# EAGLE design Session 4 (EAGLE 9.6.2)
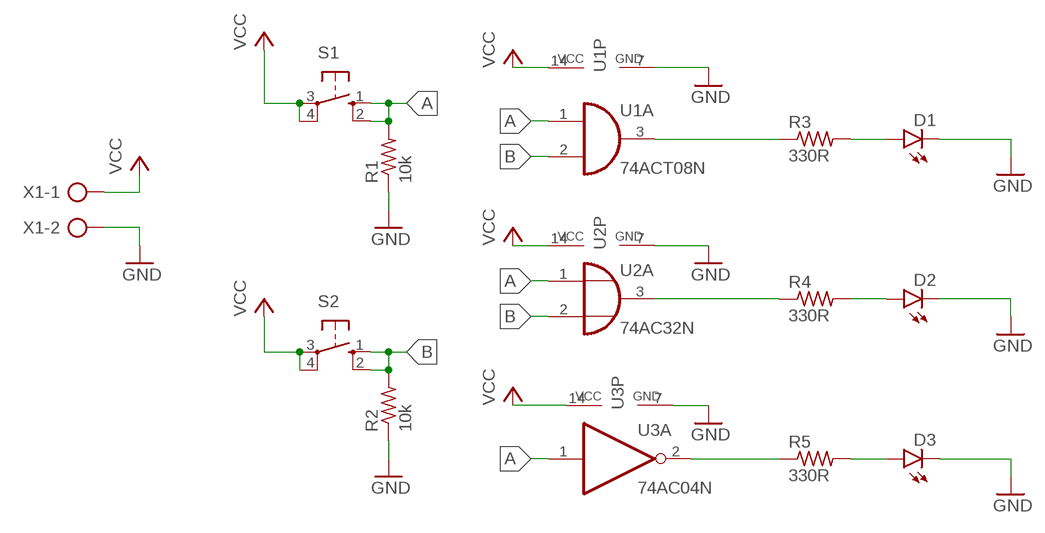
[diagram p0: schematic, sheet 1]

## Parts
D1  LED5MM  [LED5MM]
D2  LED5MM  [LED5MM]
D3  LED5MM  [LED5MM]
R1  10k  R-US_0204/7  [0204/7]
R2  10k  R-US_0204/7  [0204/7]
R3  330R  R-US_0204/7  [0204/7]
R4  330R  R-US_0204/7  [0204/7]
R5  330R  R-US_0204/7  [0204/7]
S1  10-XX  [B3F-10XX]
S2  10-XX  [B3F-10XX]
U1  74ACT08N  [DIL14]
U2  74AC32N  [DIL14]
U3  74AC04N  [DIL14]
X1  AK500/2  [AK500/2]

## Nets
A: R1.2 S1.1(S) S1.2(S1) U1.1(A:I0) U2.1(A:I0) U3.1(A:I)
B: R2.2 S2.1(S) S2.2(S1) U1.2(A:I1) U2.2(A:I1)
GND: D1.K(C) D2.K(C) D3.K(C) R1.1 R2.1 U1.7(P:GND) U2.7(P:GND) U3.7(P:GND) X1.2
N$4: R3.1 U1.3(A:O)
N$5: D1.A R3.2
N$6: R5.1 U3.2(A:O)
N$7: D3.A R5.2
N$9: D2.A R4.2
N$10: R4.1 U2.3(A:O)
VCC: S1.3(P) S1.4(P1) S2.3(P) S2.4(P1) U1.14(P:VCC) U2.14(P:VCC) U3.14(P:VCC) X1.1
Unconnected: U1.4(B:I0) U1.5(B:I1) U1.6(B:O) U1.8(C:O) U1.9(C:I0) U1.10(C:I1) U1.11(D:O) U1.12(D:I0) U1.13(D:I1) U2.4(B:I0) U2.5(B:I1) U2.6(B:O) U2.8(C:O) U2.9(C:I0) U2.10(C:I1) U2.11(D:O) U2.12(D:I0) U2.13(D:I1) U3.3(B:I) U3.4(B:O) U3.5(C:I) U3.6(C:O) U3.8(D:O) U3.9(D:I) U3.10(E:O) U3.11(E:I) U3.12(F:O) U3.13(F:I)

## Library data of the parts
D1-D3 = led:LED: LED OSRAM: - CHIPLED LG R971, LG N971, LY N971, LG Q971, LY Q971, LO R971, LY R971 LH N974, LH R974 LS Q976, LO Q976, LY Q976 LO Q996 - Hyper CHIPLED LW Q18S LB Q993, LB Q99A, LB R99A - SideLED LS A670, LO A670, LY A670, LG A670, LP A670 LB A673, LV A673, LT A673, LW A673 LH A674 LY A675 LS A676, LA A676, LO A676, LY A676, LW A676 LS A679, LY A679, LG A679 - Hyper Micro SIDELED® LS Y876, LA Y876, LO Y876, LY Y876 LT Y87S - SmartLED LW L88C, LW L88S LB L89C, LB L89S, LG L890 LS L89K, LO L89K, LY L89K LS L896, LA L896, LO L896, LY L896 - TOPLED LS T670, LO T670, LY T670, LG T670, LP T670 LSG T670, LSP T670, LSY T670, LOP T670, LYG T670 LG T671, LOG T671, LSG T671 LB T673, LV T673, LT T673, LW T673 LH T674 LS T676, LA T676, LO T676, LY T676, LB T676, LH T676, LSB T676, LW T676 LB T67C, LV T67C, LT T67C, LS T67K, LO T67K, LY T67K, LW E67C LS E67B, LA E67B, LO E67B, LY E67B, LB E67C, LV E67C, LT E67C LW T67C LS T679, LY T679, LG T679 LS T770, LO T770, LY T770, LG T770, LP T770 LB T773, LV T773, LT T773, LW T773 LH T774 LS E675, LA E675, LY E675, LS T675 LS T776, LA T776, LO T776, LY T776, LB T776 LHGB T686 LT T68C, LB T68C - Hyper Mini TOPLED® LB M676 - Mini TOPLED Santana® LG M470 LS M47K, LO M47K, LY M47K Source: http://www.osram.convergy.de LUXEON: - LUMILED® LXK2-PW12-R00, LXK2-PW12-S00, LXK2-PW14-U00, LXK2-PW14-V00 LXK2-PM12-R00, LXK2-PM12-S00, LXK2-PM14-U00 LXK2-PE12-Q00, LXK2-PE12-R00, LXK2-PE12-S00, LXK2-PE14-T00, LXK2-PE14-U00 LXK2-PB12-K00, LXK2-PB12-L00, LXK2-PB12-M00, LXK2-PB14-N00, LXK2-PB14-P00, LXK2-PB14-Q00 LXK2-PR12-L00, LXK2-PR12-M00, LXK2-PR14-Q00, LXK2-PR14-R00 LXK2-PD12-Q00, LXK2-PD12-R00, LXK2-PD12-S00 LXK2-PH12-R00, LXK2-PH12-S00 LXK2-PL12-P00, LXK2-PL12-Q00, LXK2-PL12-R00 Source: www.luxeon.com KINGBRIGHT: KA-3528ASYC Source: www.kingbright.com
R1-R5 = rcl:R-US_: RESISTOR, American symbol; SPICEPREFIX: R
S1 S2 = switch-omron:10-XX: OMRON SWITCH; MPN: B3F-1000; OC_FARNELL: 176432; OC_NEWARK: 36M3542
U1 = 74xx-eu:74*08: Quad 2-input AND gate
U2 = 74xx-eu:74*32: Quad 2-input OR gate
U3 = 74xx-eu:74*04: Hex INVERTER
X1 = con-ptr500:AK500/2: CONNECTOR; OC_FARNELL: unknown; OC_NEWARK: unknown

## Board
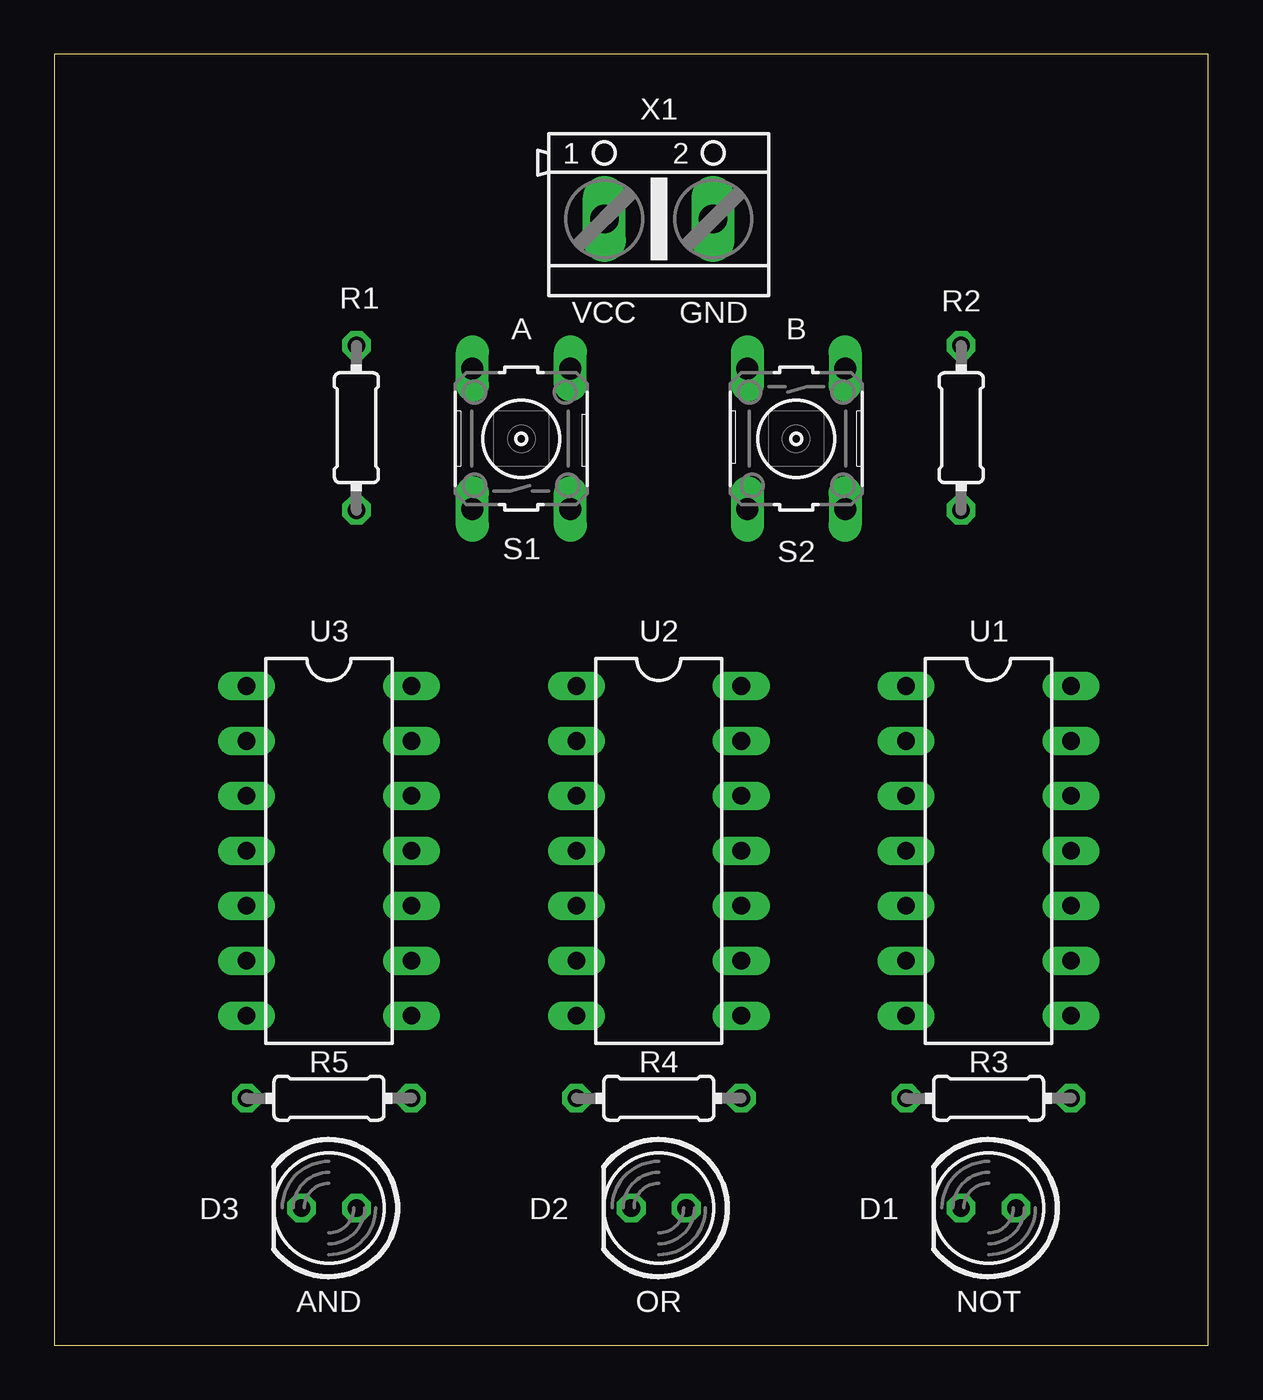
[diagram p1: board, top side]
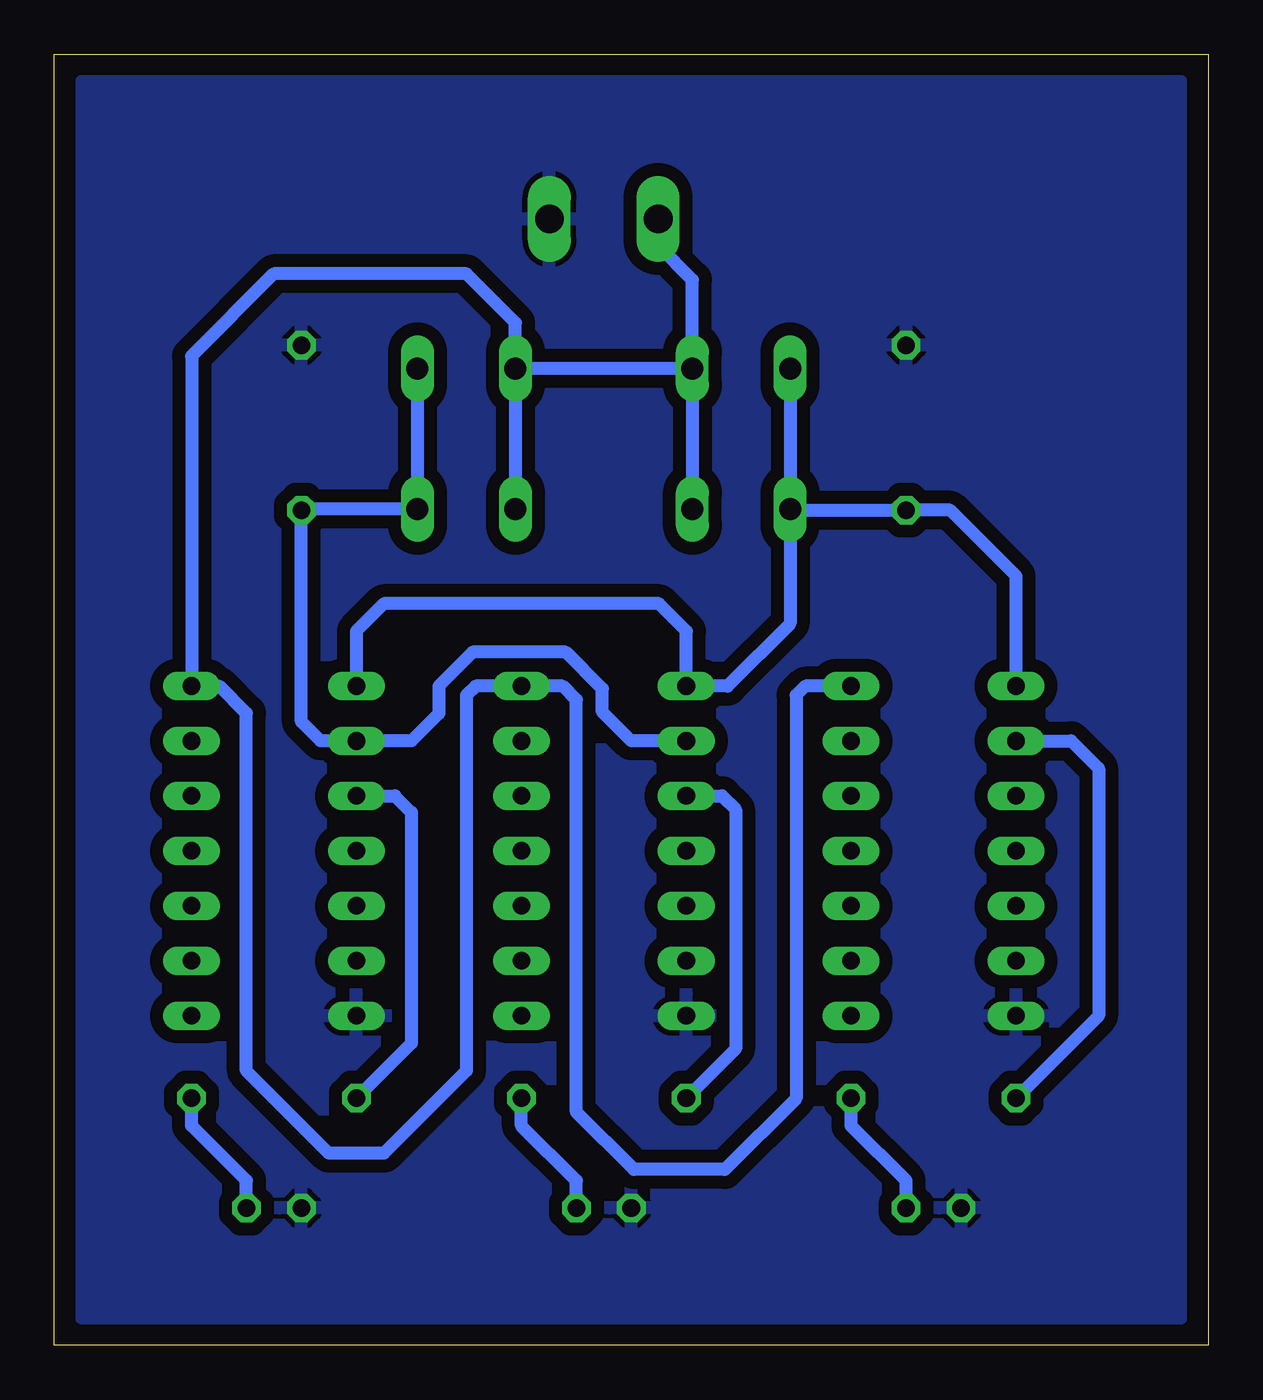
[diagram p2: board, bottom side, seen from below]

Size 53.34 x 59.69 mm. Coordinates in mm from the lower left corner, seen from the top.
Outline: 0,0 53.34,0 53.34,59.69 0,59.69 0,0
Copper layers (1*16): Top 0.035mm / dielectric 1.5mm / Bottom 0.035mm
Design rules "default *": minimum track width 0.6mm, minimum drill 0.6mm, track to track 0.6mm, track to pad 0.6mm, pad to pad 0.6mm, via to via 0.6mm, smd to smd 6mil, copper to edge 0.6mm, drill to drill 0.6mm, minimum pad ring 10mil, minimum via ring 8mil, stop-mask expansion 4mil, vias tented up to drill 0mil, thermal gap 10mil

### Footprints (pad centres in the part's own frame; a part is rotated, then mirrored left to right if it is on the bottom)
LED5MM = drill 0.813 octagon: A -1.27,0; K 1.27,0
0204/7 = drill 0.813 octagon: 1 -3.81,0; 2 3.81,0
B3F-10XX = drill 1.016 long: 1 -3.251,2.261; 2 3.251,2.261; 3 -3.251,-2.261; 4 3.251,-2.261
DIL14 = drill 0.813 long: 1 -7.62,-3.81; 2 -5.08,-3.81; 3 -2.54,-3.81; 4 0,-3.81; 5 2.54,-3.81; 6 5.08,-3.81; 7 7.62,-3.81; 8 7.62,3.81; 9 5.08,3.81; 10 2.54,3.81; 11 0,3.81; 12 -2.54,3.81; 13 -5.08,3.81; 14 -7.62,3.81
AK500/2 = drill 1.321 long: 1 -2.515,0; 2 2.515,0

### Placement (x,y rotation side)
D1  43.18,6.35 180 top
D2  27.94,6.35 180 top
D3  12.7,6.35 180 top
R1  13.97,42.42 270 top
R2  41.91,42.42 270 top
R3  43.18,11.43 0 top
R4  27.94,11.43 0 top
R5  12.7,11.43 0 top
S1  21.59,41.91 90 top
S2  34.29,41.91 270 top
U1  43.18,22.86 270 top
U2  27.94,22.86 270 top
U3  12.7,22.86 270 top
X1  27.94,52.07 0 top

### Tracks (layer width: path | path; a pad name or v marks a point on that pad's centre or on a via)
A
  Bottom 0.6: S1.2 S1.1 | S1.1 19.28,38.61 R1.2 11.94,38.61 8.89,35.56 U3.1 | U1.1 39.37,33.02 38.1,34.29 25.4,34.29 24.13,33.02 U2.1 22.23,30.48 19.33,33.38 S1.1
B
  Bottom 0.6: S2.1 S2.2 41.86,38.66 R2.2 41.91,28.83 41.02,27.94 U1.2 36.83,27.94 35.56,29.21 35.56,30.48 34,32.04 29.71,32.04 28.01,30.34 28.01,29.28 26.67,27.94 U2.2
GND
  pour Bottom: 1.27,1.27 1.27,58.42 52.07,58.42 52.07,1.27
N$4
  Bottom 0.6: U1.3 37.59,25.4 36.83,24.64 36.83,13.97 R3.1
N$5
  Bottom 0.6: D1.A 44.45,7.62 46.99,10.16 R3.2
N$6
  Bottom 0.6: U3.2 6.35,27.94 5.08,26.67 5.08,15.24 R5.1
N$7
  Bottom 0.6: D3.A 13.97,7.62 16.51,10.16 R5.2
N$9
  Bottom 0.6: D2.A 29.21,7.62 31.75,10.16 R4.2
N$10
  Bottom 0.6: U2.3 22.48,25.4 21.84,24.77 21.84,13.72 R4.1
VCC
  Bottom 0.6: S1.4 S2.3 | S1.4 S1.3 | S2.3 S2.4 | U3.14 18.62,30.48 19.05,30.05 19.05,11.43 22.35,8.13 26.54,8.13 29.21,10.79 29.21,29.84 29.84,30.48 U2.14 33.86,30.48 34.29,30.05 34.29,12.7 38.1,8.89 40.64,8.89 44.45,12.7 44.45,29.21 45.72,30.48 U1.14 46.99,45.72 43.18,49.53 34.29,49.53 32.03,47.27 S2.3 | X1.1 25.42,50.82 23.85,49.25 S1.4

### Text on the board
tPlace: VCC | GND | A | B | AND | OR | NOT